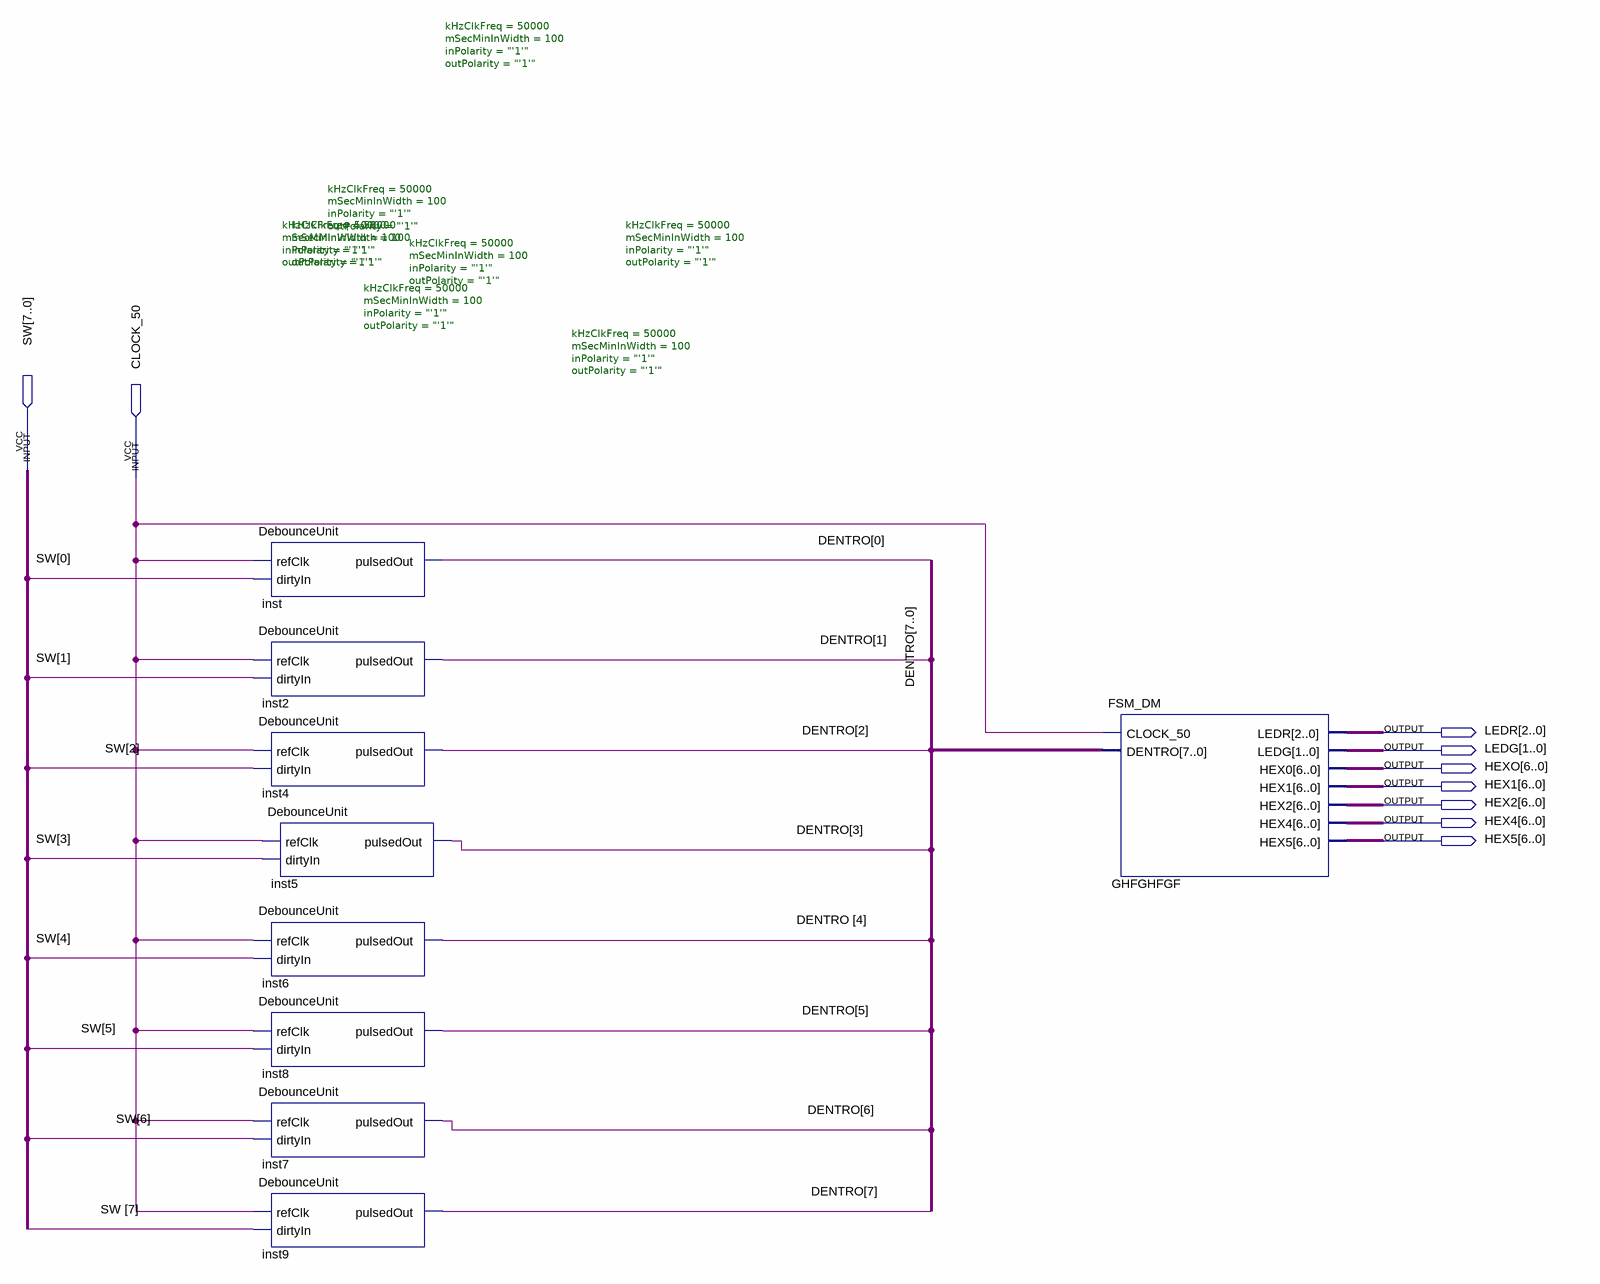
[diagram p0: schematic sheet]
// Quartus schematic Top_Level_debouncing.bdf as structural Verilog: 9 symbols, 9 pins
module Top_Level_debouncing (
  input  [7:0] SW,
  input  CLOCK_50,
  output [2:0] LEDR,
  output [1:0] LEDG,
  output [6:0] HEXO,
  output [6:0] HEX1,
  output [6:0] HEX2,
  output [6:0] HEX4,
  output [6:0] HEX5
);

  wire [7:0] DENTRO;

  DebounceUnit #(.kHzClkFreq(50000), .mSecMinInWidth(100), .inPolarity("'1'"), .outPolarity("'1'")) inst (
    .refClk(CLOCK_50), .dirtyIn(SW[0]), .pulsedOut(DENTRO[0]));
  DebounceUnit #(.kHzClkFreq(50000), .mSecMinInWidth(100), .inPolarity("'1'"), .outPolarity("'1'")) inst2 (
    .refClk(CLOCK_50), .dirtyIn(SW[1]), .pulsedOut(DENTRO[1]));
  DebounceUnit #(.kHzClkFreq(50000), .mSecMinInWidth(100), .inPolarity("'1'"), .outPolarity("'1'")) inst4 (
    .refClk(CLOCK_50), .dirtyIn(SW[2]), .pulsedOut(DENTRO[2]));
  DebounceUnit #(.kHzClkFreq(50000), .mSecMinInWidth(100), .inPolarity("'1'"), .outPolarity("'1'")) inst5 (
    .refClk(CLOCK_50), .dirtyIn(SW[3]), .pulsedOut(DENTRO[3]));
  DebounceUnit #(.kHzClkFreq(50000), .mSecMinInWidth(100), .inPolarity("'1'"), .outPolarity("'1'")) inst6 (
    .refClk(CLOCK_50), .dirtyIn(SW[4]), .pulsedOut(DENTRO[4]));
  DebounceUnit #(.kHzClkFreq(50000), .mSecMinInWidth(100), .inPolarity("'1'"), .outPolarity("'1'")) inst8 (
    .refClk(CLOCK_50), .dirtyIn(SW[5]), .pulsedOut(DENTRO[5]));
  DebounceUnit #(.kHzClkFreq(50000), .mSecMinInWidth(100), .inPolarity("'1'"), .outPolarity("'1'")) inst7 (
    .refClk(CLOCK_50), .dirtyIn(SW[6]), .pulsedOut(DENTRO[6]));
  DebounceUnit #(.kHzClkFreq(50000), .mSecMinInWidth(100), .inPolarity("'1'"), .outPolarity("'1'")) inst9 (
    .refClk(CLOCK_50), .dirtyIn(SW[7]), .pulsedOut(DENTRO[7]));
  FSM_DM GHFGHFGF (
    .CLOCK_50(CLOCK_50), .DENTRO(DENTRO), .LEDR(LEDR), .LEDG(LEDG), .HEX0(HEXO), .HEX1(HEX1), .HEX2(HEX2),
    .HEX4(HEX4), .HEX5(HEX5));
endmodule
